# Altium schematic sheet Sheet1.SchDoc
size A4; SheetNumber: 1; SheetTotal: 1
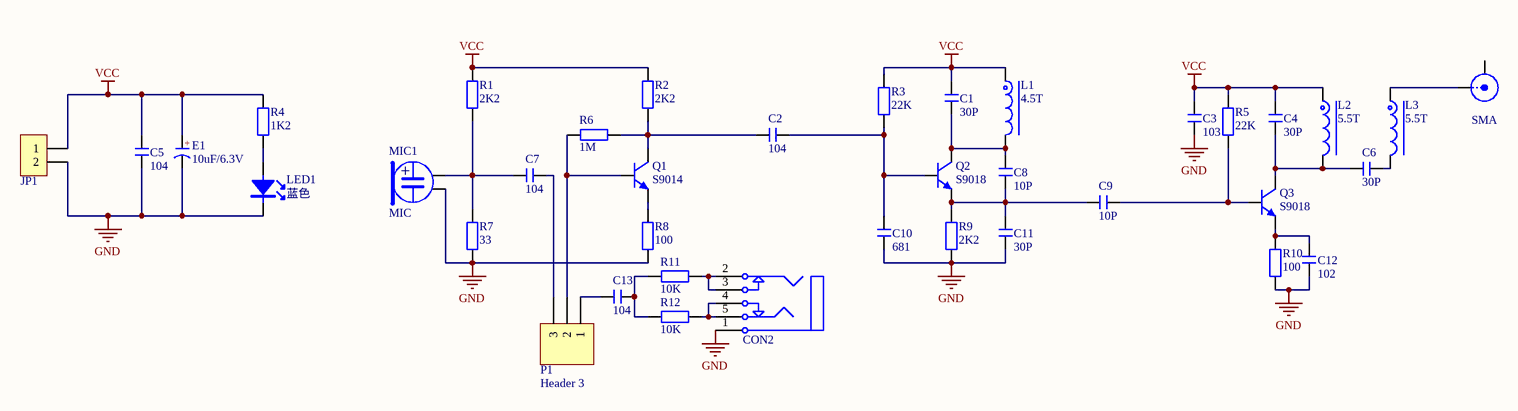
[diagram p0: Sheet1.SchDoc]

## Parts
C1  30P  [C 0805_M]
C2  104  [C 0805_M]
C3  103  [C 0805_M]
C4  30P  [C 0805_M]
C5  104  [C 0805_M]
C6  30P  [C 0805_M]
C7  104  [C 0805_M]
C8  10P  [C 0805_M]
C9  10P  [C 0805_M]
C10  681  [C 0805_M]
C11  30P  [C 0805_M]
C12  102  [C 0805_M]
C13  104  [C 0805_M]
CON1  SMA  [RCA RJ-255]
CON2  3F07_BK  [3F07_PK]  (value not drawn)
E1  10uF/6.3V  [CD C(6032)]
JP1  HDR-1X2  [KF2EDGK5.0-LI-2P]  (value not drawn)
L1  4.5T  [L]
L2  5.5T  [L]
L3  5.5T  [L]
LED1  蓝色  [LED 0805B]
MIC1  MIC  [MIC-6*5.5mm]
P1  Header 3  [HDR1X3]
Q1  S9014  [SOT23-3M]
Q2  S9018  [SOT23-3M]
Q3  S9018  [SOT23-3M]
R1  2K2  [R 0805_M]
R2  2K2  [R 0805_M]
R3  22K  [R 0805_M]
R4  1K2  [R 0805_M]
R5  22K  [R 0805_M]
R6  1M  [R 0805_M]
R7  33  [R 0805_M]
R8  100  [R 0805_M]
R9  2K2  [R 0805_M]
R10  100  [R 0805_M]
R11  10K  [R 0805_M]
R12  10K  [R 0805_M]

## Nets
GND: C3.2 C5.1 C10.2 C11.2 C12.2 CON2.1 E1.2(K) JP1.2 LED1.2(K) MIC1.2 R7.1 R8.1 R9.1 R10.1
VCC: C1.1 C3.1 C4.1 C5.2 E1.1(A) JP1.1 L1.1 L2.1 R1.2 R2.2 R3.2 R4.2 R5.2
NetC1_2: C1.2 C8.1 L1.2 Q2.3(C)
NetC2_1: C2.1 C10.1 Q2.1(B) R3.1
NetC2_2: C2.2 Q1.3(C) R2.1 R6.1
NetC4_2: C4.2 C6.1 L2.2 Q3.3(C)
NetC6_2: C6.2 L3.2
NetC7_1: C7.1 P1.3
NetC7_2: C7.2 MIC1.1 R1.1 R7.2
NetC8_2: C8.2 C9.1 C11.1 Q2.2(E) R9.2
NetC9_2: C9.2 Q3.1(B) R5.1
NetC12_1: C12.1 Q3.2(E) R10.2
NetC13_1: C13.1 P1.1
NetC13_2: C13.2 R11.1 R12.1
NetCON1_1: CON1.1(X) L3.1
NetCON2_2: CON2.2 CON2.3 R11.2
NetCON2_4: CON2.4 CON2.5 R12.2
NetLED1_1: LED1.1(A) R4.1
NetP1_2: P1.2 Q1.1(B) R6.2
NetQ1_2: Q1.2(E) R8.2

Not connected (* = marked no-connect by the designer): CON1 2(Y)

## Notes on the sheet
- (in symbol CT) +
- (in symbol MIC) +

## Library data of the parts
C1-C13 = C: 贴片电容; 淘宝ID: 小糖豆的小窝窝; BOM名称: 贴片电容; 下单链接: https://item.taobao.com/item.htm?ft=t&id=613637044352
CON1 = SMA: RCA莲花头AV座; 淘宝ID: 小糖豆的小窝窝; BOM名称: RCA莲花头AV座; 下单链接: https://item.taobao.com/item.htm?ft=t&id=613637044352
CON2 = 3F07: 3.5mm耳机插座; 淘宝ID: 小糖豆的小窝窝; BOM名称: 3.5mm耳机插座; 下单链接: https://item.taobao.com/item.htm?ft=t&id=613637044352
E1 = CT: 贴片钽电容; 淘宝ID: 小糖豆的小窝窝; BOM名称: 贴片钽电容; 下单链接: https://item.taobao.com/item.htm?ft=t&id=613637044352
JP1 = Header 2: 2P接插件; 淘宝ID: 小糖豆的小窝窝; BOM名称: 2P接插件; 下单链接: https://item.taobao.com/item.htm?ft=t&id=613637044352
L1-L3 = L-PK: 工字电感; 淘宝ID: 小糖豆的小窝窝; BOM名称: 工字电感; 下单链接: https://item.taobao.com/item.htm?ft=t&id=613637044352
LED1 = LED-SMD: 贴片LED; 淘宝ID: 小糖豆的小窝窝; BOM名称: 贴片LED; 下单链接: https://item.taobao.com/item.htm?ft=t&id=613637044352
MIC1 = MIC: 电容麦克风; 淘宝ID: 小糖豆的小窝窝; BOM名称: 电容麦克风; 下单链接: https://item.taobao.com/item.htm?ft=t&id=613637044352
P1 = Header 3: Header, 3-Pin; LatestRevisionDate: 17-Jul-2002; LatestRevisionNote: Re-released for DXP Platform.; Publisher: Altium Limited
Q1-Q3 = 9014-SMD: 低噪放大-NPN型; 淘宝ID: 小糖豆的小窝窝; BOM名称: 低噪放大-NPN型; 下单链接: https://item.taobao.com/item.htm?ft=t&id=613637044352
R1-R12 = R: 贴片电阻; 淘宝ID: 小糖豆的小窝窝; BOM名称: 贴片电阻; 下单链接: https://item.taobao.com/item.htm?ft=t&id=613637044352